# EAGLE design rStep_v2 (EAGLE 5.08)
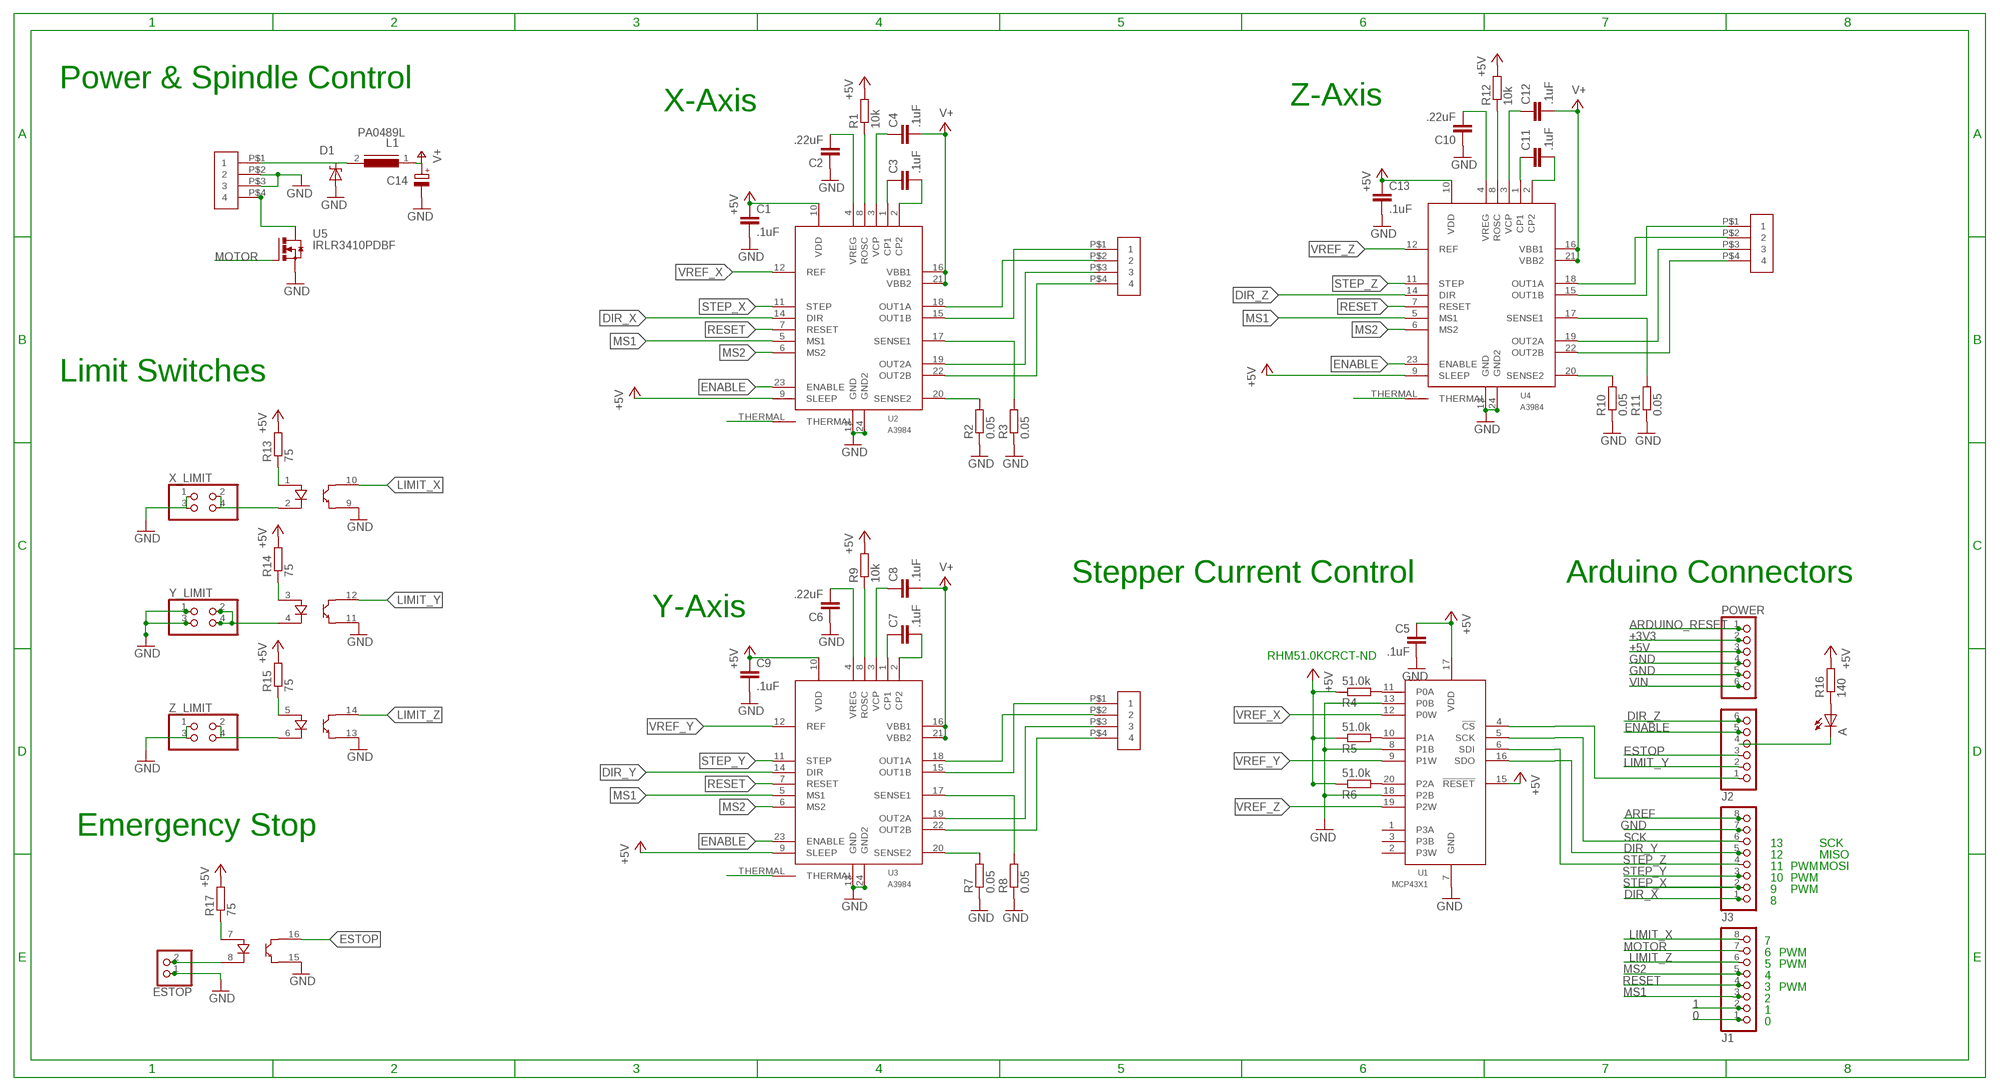
[diagram p0: schematic, sheet 1]

## Parts
A  LEDCHIP-LED0805  [CHIP-LED0805]
C1  .1uF  C-EUC0805  [C0805]
C2  .22uF  C-EUC0805  [C0805]
C3  .1uF  C-EUC0805  [C0805]
C4  .1uF  C-EUC0805  [C0805]
C5  .1uF  C-EUC0805  [C0805]
C6  .22uF  C-EUC0805  [C0805]
C7  .1uF  C-EUC0805  [C0805]
C8  .1uF  C-EUC0805  [C0805]
C9  .1uF  C-EUC0805  [C0805]
C10  .22uF  C-EUC0805  [C0805]
C11  .1uF  C-EUC0805  [C0805]
C12  .1uF  C-EUC0805  [C0805]
C13  .1uF  C-EUC0805  [C0805]
C14  CPOL-EUE5-10.5  [E5-10,5]
D1  SUPPRESSOR-SMBJ  [SMBJ]
ESTOP  PINHD-1X2  [1X02]
J1  PINHD-1X8  [1X08]
J2  PINHD-1X6  [1X06]
J3  PINHD-1X8  [1X08]
L1  PA0489L  [PA0489L]
POWER  PINHD-1X6  [1X06]
R1  10k  R-EU_R0805  [R0805]
R2  0.05  R-EU_R1206  [R1206]
R3  0.05  R-EU_R1206  [R1206]
R4  51.0k  R-EU_R0805  [R0805]
R5  51.0k  R-EU_R0805  [R0805]
R6  51.0k  R-EU_R0805  [R0805]
R7  0.05  R-EU_R1206  [R1206]
R8  0.05  R-EU_R1206  [R1206]
R9  10k  R-EU_R0805  [R0805]
R10  0.05  R-EU_R1206  [R1206]
R11  0.05  R-EU_R1206  [R1206]
R12  10k  R-EU_R0805  [R0805]
R13  75  R-EU_R0805  [R0805]
R14  75  R-EU_R0805  [R0805]
R15  75  R-EU_R0805  [R0805]
R16  140  R-EU_R0805  [R0805]
R17  75  R-EU_R0805  [R0805]
U1  MCP43X1  [TSSOP20]
U2  A3984  [TSSOP24]
U3  A3984  [TSSOP24]
U4  A3984  [TSSOP24]
U5  IRLR3410PDBF  [TO252]
U6  TCET4100  [DIL16]
X1  284392-4  [284392-4]
X2  284392-4  [284392-4]
X3  284392-4  [284392-4]
X5  OSTTC04262  [OSTTC042162]
X_LIMIT  PINHD-2X2  [2X02]
Y_LIMIT  PINHD-2X2  [2X02]
Z_LIMIT  PINHD-2X2  [2X02]

## Nets
0: J1.1
1: J1.2
!CS: J2.1 U1.4(!CS)
+3V3: POWER.2
+5V: C1.1 C5.1 C9.1 C13.1 POWER.3 R1.2 R4.1 R5.1 R6.1 R9.2 R12.2 R13.2 R14.2 R15.2 R16.2 R17.2 U1.15(!RESET) U1.17(VDD) U2.9(SLEEP) U2.10(VDD) U3.9(SLEEP) U3.10(VDD) U4.9(SLEEP) U4.10(VDD)
ARDUINO_RESET: POWER.1
AREF: J3.8
DIR_X: J3.1 U2.14(DIR)
DIR_Y: J3.5 U1.16(SDO) U3.14(DIR)
DIR_Z: J2.6 U4.14(DIR)
ENABLE: J2.5 U2.23(ENABLE) U3.23(ENABLE) U4.23(ENABLE)
ESTOP: J2.3 U6.16(C)
GND: C1.2 C2.1 C5.2 C6.1 C9.2 C10.1 C13.2 C14.- D1.A ESTOP.1 J3.7 POWER.4 POWER.5 R2.1 R3.1 R7.1 R8.1 R10.1 R11.1 U1.7(GND) U1.8(P1B) U1.13(P0B) U1.18(P2B) U2.13(GND) U2.24(GND2) U3.13(GND) U3.24(GND2) U4.13(GND) U4.24(GND2) U5.2(S) U6.9(E) U6.11(E) U6.13(E) U6.15(E) X5.P$2 X5.P$3 X_LIMIT.1 X_LIMIT.3 Y_LIMIT.1 Y_LIMIT.3 Z_LIMIT.1 Z_LIMIT.3
LIMIT_X: J1.8 U6.10(C)
LIMIT_Y: J2.2 U6.12(C)
LIMIT_Z: J1.6 U6.14(C)
MOTOR: J1.7 U5.1(G)
MS1: J1.3 U2.5(MS1) U3.5(MS1) U4.5(MS1)
MS2: J1.5 U2.6(MS2) U3.6(MS2) U4.6(MS2)
N$1: C2.2 U2.4(VREG)
N$2: C3.1 U2.1(CP1)
N$3: C3.2 U2.2(CP2)
N$4: C4.1 U2.3(VCP)
N$5: U2.18(OUT1A) X1.P$2
N$6: U2.15(OUT1B) X1.P$1
N$7: U2.19(OUT2A) X1.P$3
N$8: U2.22(OUT2B) X1.P$4
N$9: R1.1 U2.8(ROSC)
N$10: C6.2 U3.4(VREG)
N$11: C7.1 U3.1(CP1)
N$12: C7.2 U3.2(CP2)
N$13: C8.1 U3.3(VCP)
N$14: U3.18(OUT1A) X2.P$2
N$15: U3.15(OUT1B) X2.P$1
N$16: R3.2 U2.17(SENSE1)
N$17: R2.2 U2.20(SENSE2)
N$18: U3.19(OUT2A) X2.P$3
N$19: R4.2 U1.11(P0A)
N$20: R5.2 U1.10(P1A)
N$21: R6.2 U1.20(P2A)
N$22: U3.22(OUT2B) X2.P$4
N$23: R8.2 U3.17(SENSE1)
N$24: R7.2 U3.20(SENSE2)
N$25: R9.1 U3.8(ROSC)
N$26: C10.2 U4.4(VREG)
N$27: C11.1 U4.1(CP1)
N$28: C11.2 U4.2(CP2)
N$29: C12.1 U4.3(VCP)
N$30: U4.18(OUT1A) X3.P$2
N$31: U4.15(OUT1B) X3.P$1
N$32: U4.19(OUT2A) X3.P$3
N$33: U4.22(OUT2B) X3.P$4
N$34: R11.2 U4.17(SENSE1)
N$35: R10.2 U4.20(SENSE2)
N$36: R12.1 U4.8(ROSC)
N$37: A.A R16.1
N$38: D1.C L1.2 X5.P$1
N$39: R13.1 U6.1(A)
N$40: U6.6(K) Z_LIMIT.2 Z_LIMIT.4
N$41: R14.1 U6.3(A)
N$42: U6.4(K) Y_LIMIT.2 Y_LIMIT.4
N$43: R15.1 U6.5(A)
N$45: U6.2(K) X_LIMIT.2 X_LIMIT.4
N$46: A.C J2.4
N$47: R17.1 U6.7(A)
N$48: ESTOP.2 U6.8(K)
N$50: U5.3(D) X5.P$4
RESET: J1.4 U2.7(RESET) U3.7(RESET) U4.7(RESET)
SCK: J3.6 U1.5(SCK)
STEP_X: J3.2 U2.11(STEP)
STEP_Y: J3.3 U3.11(STEP)
STEP_Z: J3.4 U1.6(SDI) U4.11(STEP)
THERMAL: U2.THERMAL U3.THERMAL U4.THERMAL
V+: C4.2 C8.2 C12.2 C14.+ L1.1 U2.16(VBB1) U2.21(VBB2) U3.16(VBB1) U3.21(VBB2) U4.16(VBB1) U4.21(VBB2)
VIN: POWER.6
VREF_X: U1.12(P0W) U2.12(REF)
VREF_Y: U1.9(P1W) U3.12(REF)
VREF_Z: U1.19(P2W) U4.12(REF)
Unconnected: U1.1(P3A) U1.2(P3W) U1.3(P3B)

## Notes on the sheet
- Power & Spindle Control
- X-Axis | Z-Axis
- Limit Switches
- Stepper Current Control | Arduino Connectors
- Y-Axis
- RHM51.0KCRCT-ND
- Emergency Stop
- 13 | SCK
- 12 | MISO
- 11 | PWM | MOSI
- 10 | PWM
- 9 | PWM
- 8
- 7
- 6 | PWM
- 5 | PWM
- 4
- 3 | PWM
- 2
- 1
- 0

## Library data of the parts
A = led:LED: LED OSRAM: - CHIPLED LG R971, LG N971, LY N971, LG Q971, LY Q971, LO R971, LY R971 LH N974, LH R974 LS Q976, LO Q976, LY Q976 LO Q996 - Hyper CHIPLED LW Q18S LB Q993, LB Q99A, LB R99A - SideLED LS A670, LO A670, LY A670, LG A670, LP A670 LB A673, LV A673, LT A673, LW A673 LH A674 LY A675 LS A676, LA A676, LO A676, LY A676, LW A676 LS A679, LY A679, LG A679 - Hyper Micro SIDELED® LS Y876, LA Y876, LO Y876, LY Y876 LT Y87S - SmartLED LW L88C, LW L88S LB L89C, LB L89S, LG L890 LS L89K, LO L89K, LY L89K LS L896, LA L896, LO L896, LY L896 - TOPLED LS T670, LO T670, LY T670, LG T670, LP T670 LSG T670, LSP T670, LSY T670, LOP T670, LYG T670 LG T671, LOG T671, LSG T671 LB T673, LV T673, LT T673, LW T673 LH T674 LS T676, LA T676, LO T676, LY T676, LB T676, LH T676, LSB T676, LW T676 LB T67C, LV T67C, LT T67C, LS T67K, LO T67K, LY T67K, LW E67C LS E67B, LA E67B, LO E67B, LY E67B, LB E67C, LV E67C, LT E67C LW T67C LS T679, LY T679, LG T679 LS T770, LO T770, LY T770, LG T770, LP T770 LB T773, LV T773, LT T773, LW T773 LH T774 LS E675, LA E675, LY E675, LS T675 LS T776, LA T776, LO T776, LY T776, LB T776 LHGB T686 LT T68C, LB T68C - Hyper Mini TOPLED® LB M676 - Mini TOPLED Santana® LG M470 LS M47K, LO M47K, LY M47K Source: http://www.osram.convergy.de LUXEON: - LUMILED® LXK2-PW12-R00, LXK2-PW12-S00, LXK2-PW14-U00, LXK2-PW14-V00 LXK2-PM12-R00, LXK2-PM12-S00, LXK2-PM14-U00 LXK2-PE12-Q00, LXK2-PE12-R00, LXK2-PE12-S00, LXK2-PE14-T00, LXK2-PE14-U00 LXK2-PB12-K00, LXK2-PB12-L00, LXK2-PB12-M00, LXK2-PB14-N00, LXK2-PB14-P00, LXK2-PB14-Q00 LXK2-PR12-L00, LXK2-PR12-M00, LXK2-PR14-Q00, LXK2-PR14-R00 LXK2-PD12-Q00, LXK2-PD12-R00, LXK2-PD12-S00 LXK2-PH12-R00, LXK2-PH12-S00 LXK2-PL12-P00, LXK2-PL12-Q00, LXK2-PL12-R00 Source: www.luxeon.com KINGBRIGHT: KA-3528ASYC Source: www.kingbright.com
C1-C13 = rcl:C-EU: CAPACITOR, European symbol
C14 = rcl:CPOL-EU: POLARIZED CAPACITOR, European symbol
D1 = diode:SUPPRESSOR-: Suppressor diode
ESTOP = pinhead:PINHD-1X2: PIN HEADER
J1 J3 = pinhead:PINHD-1X8: PIN HEADER
J2 POWER = pinhead:PINHD-1X6: PIN HEADER
L1 = rStep:PA0489L
R1-R17 = rcl:R-EU_: RESISTOR, European symbol
U1 = rStep:MCP43X1
U2-U4 = rStep:A3984
U5 = rStep:IRLR3410PDBF
U6 = rStep:TCET4100
X1-X3 = rStep:284392-4
X5 = rStep:OSTTC04262
X_LIMIT Y_LIMIT Z_LIMIT = pinhead:PINHD-2X2: PIN HEADER

## Net classes
0 default: width 0.254 mm, clearance 0.254 mm
1 power: width 0.61 mm, drill 0.711 mm, clearance 0.33 mm
2 gnd: width 0.305 mm, drill 0.711 mm, clearance 0.254 mm
3 usbvcc: width 0.508 mm, drill 0.711 mm, clearance 0.254 mm
4 aref: width 0.406 mm

## Board
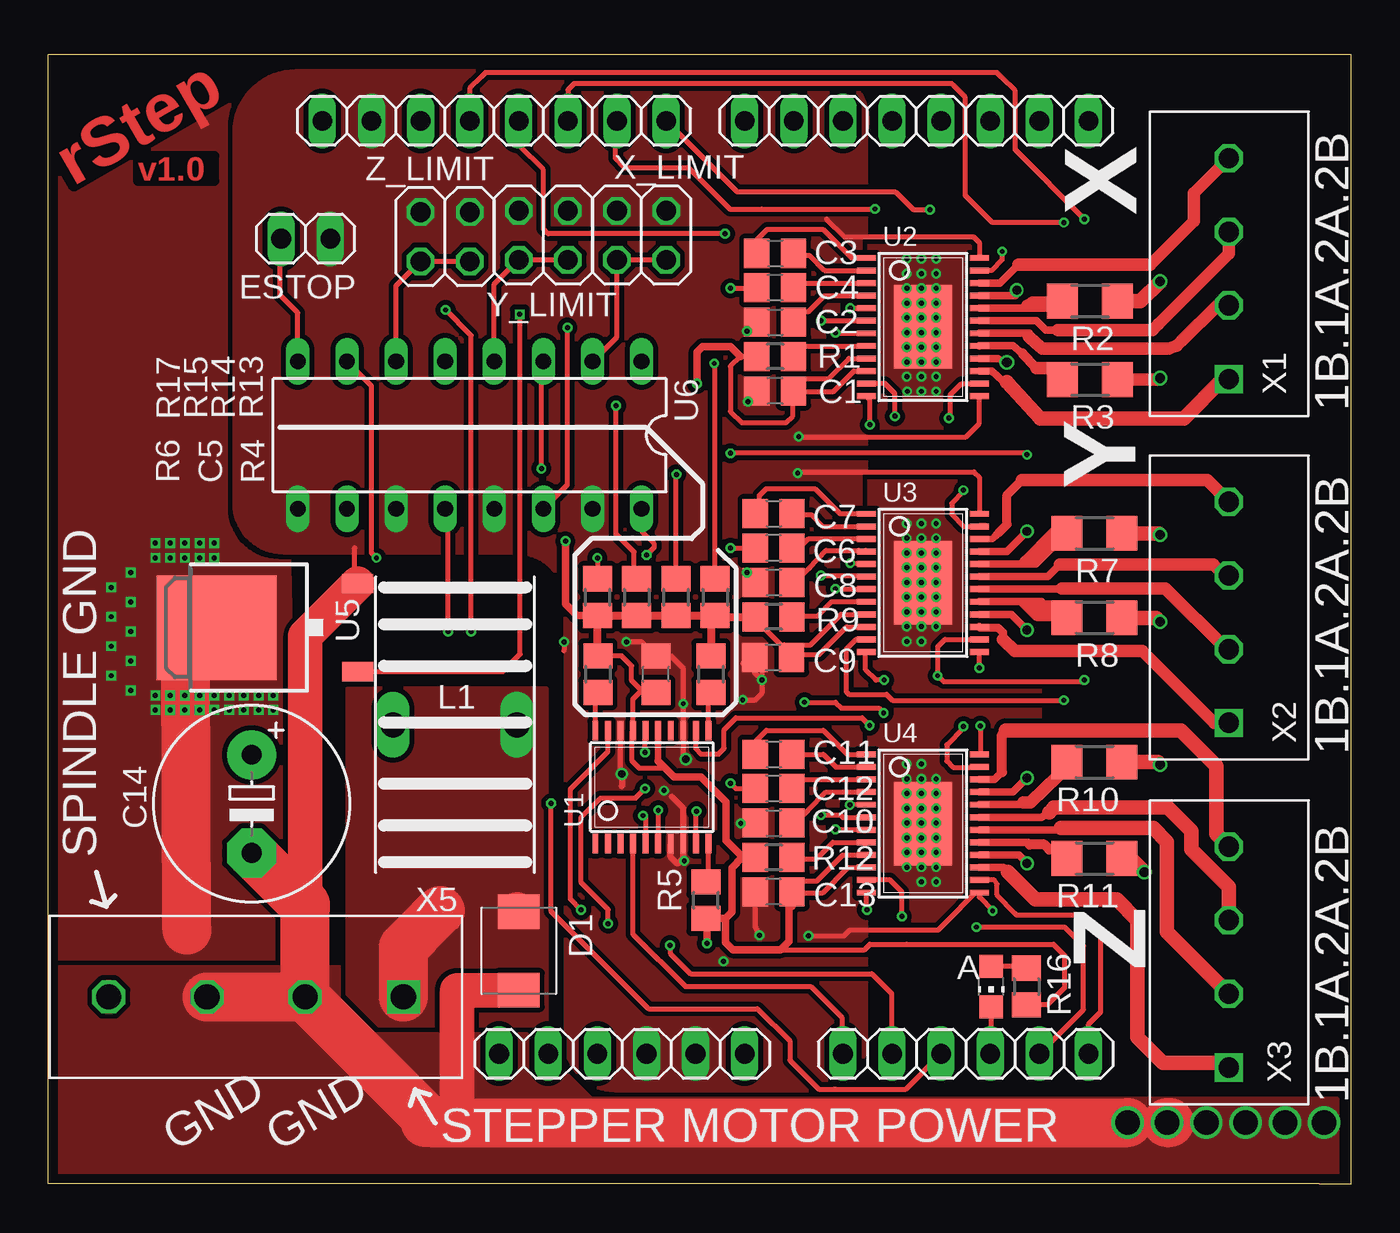
[diagram p1: board, top side]
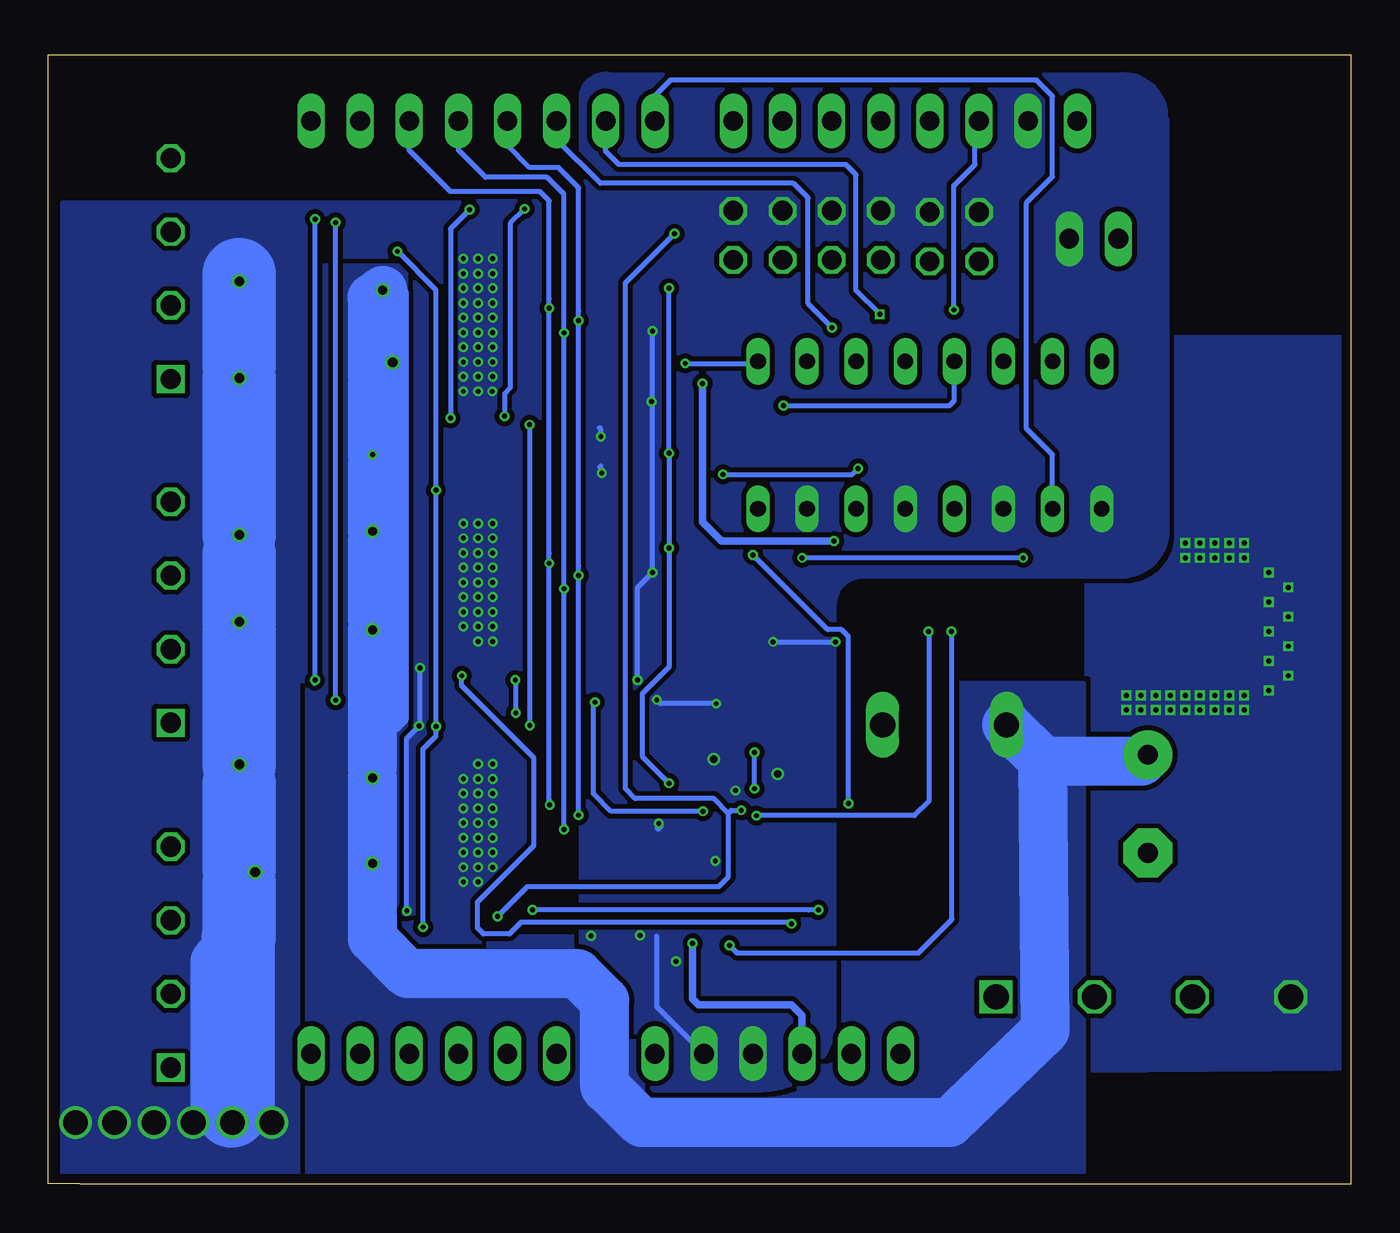
[diagram p2: board, bottom side, seen from below]

Size 67.39 x 58.42 mm. Coordinates in mm from the lower left corner, seen from the top.
Outline: 65.74,0 0,0 0,58.42 67.39,58.42 67.39,0 65.74,0
Copper layers (1*16): Top 0.035mm / dielectric 1.5mm / Bottom 0.035mm
Design rules "default *": minimum track width 10mil, minimum drill 10mil, track to track 10mil, track to pad 10mil, pad to pad 10mil, via to via 10mil, smd to smd 0mil, copper to edge 20mil, drill to drill 10mil, minimum pad ring 5mil, minimum via ring 5mil, stop-mask expansion 4mil, vias tented up to drill 0mil, thermal gap 10mil

### Footprints (pad centres in the part's own frame; a part is rotated, then mirrored left to right if it is on the bottom)
CHIP-LED0805 = smd 1.2 x 1.2: A 0,-1.05; C 0,1.05
C0805 = smd 1.3 x 1.5: 1 -0.95,0; 2 0.95,0
E5-10,5 = drill 1.016 pad 2.54 round: + -2.54,0 | drill 1.016 pad 2.54 octagon: - 2.54,0
SMBJ = smd 1.78 x 2.16: A 2.04,0; C -2.03,0
1X02 = drill 1.016 long: 1 -1.27,0; 2 1.27,0
1X08 = drill 1.016 long: 1 -8.89,0; 2 -6.35,0; 3 -3.81,0; 4 -1.27,0; 5 1.27,0; 6 3.81,0; 7 6.35,0; 8 8.89,0
1X06 = drill 1.016 long: 1 -6.35,0; 2 -3.81,0; 3 -1.27,0; 4 1.27,0; 5 3.81,0; 6 6.35,0
PA0489L = drill 1.3 long: 1 -3.2,0; 2 3.2,0
R0805 = smd 1.3 x 1.5: 1 -0.95,0; 2 0.95,0
R1206 = smd 1.6 x 1.803: 1 -1.422,0; 2 1.422,0
TSSOP20 = smd 0.305 x 0.991: 1 -2.925,-2.918; 2 -2.275,-2.918; 3 -1.625,-2.918; 4 -0.975,-2.918; 5 -0.325,-2.918; 6 0.325,-2.918; 7 0.975,-2.918; 8 1.625,-2.918; 9 2.275,-2.918; 10 2.925,-2.918; 11 2.925,2.918; 12 2.275,2.918; 13 1.625,2.918; 14 0.975,2.918; 15 0.325,2.918; 16 -0.325,2.918; 17 -0.975,2.918; 18 -1.625,2.918; 19 -2.275,2.918; 20 -2.925,2.918
TSSOP24 = smd 0.305 x 0.991: 1 -3.575,-2.918; 2 -2.925,-2.918; 3 -2.275,-2.918; 4 -1.625,-2.918; 5 -0.975,-2.918; 6 -0.325,-2.918; 7 0.325,-2.918; 8 0.975,-2.918; 9 1.625,-2.918; 10 2.275,-2.918; 11 2.925,-2.918; 12 3.575,-2.918; 13 3.575,2.918; 14 2.925,2.918; 15 2.275,2.918; 16 1.625,2.918; 17 0.975,2.918; 18 0.325,2.918; 19 -0.325,2.918; 20 -0.975,2.918; 21 -1.625,2.918; 22 -2.275,2.918; 23 -2.925,2.918; 24 -3.575,2.918 | smd 4.32 x 3: THERMAL 0,0
TO252 = smd 1 x 1.6: 1 -2.28,-4.8; 2 2.28,-4.8 | smd 5.4 x 6.2: 3 0,2.5
DIL16 = drill 0.813 long: 1 -8.89,-3.81; 2 -6.35,-3.81; 3 -3.81,-3.81; 4 -1.27,-3.81; 5 1.27,-3.81; 6 3.81,-3.81; 7 6.35,-3.81; 8 8.89,-3.81; 9 8.89,3.81; 10 6.35,3.81; 11 3.81,3.81; 12 1.27,3.81; 13 -1.27,3.81; 14 -3.81,3.81; 15 -6.35,3.81; 16 -8.89,3.81
284392-4 = drill 1.05 square: P$1 0,0 | drill 1.05 octagon: P$2 3.81,0; P$3 7.62,0; P$4 11.43,0
OSTTC042162 = drill 1.3 square: P$1 0,0 | drill 1.3 octagon: P$2 5.08,0; P$3 10.16,0; P$4 15.24,0
2X02 = drill 1.016 octagon: 1 -1.27,-1.27; 2 -1.27,1.27; 3 1.27,-1.27; 4 1.27,1.27

### Placement (x,y rotation side)
A  48.77,10.21 180 top
C1  37.59,41.02 180 top
C2  37.59,44.58 0 top
C3  37.59,48.13 0 top
C4  37.59,46.35 180 top
C5  31.42,26.37 90 top
C6  37.52,31.11 0 top
C7  37.52,34.67 0 top
C8  37.52,32.89 180 top
C9  37.49,27.23 180 top
C10  37.52,18.67 0 top
C11  37.52,22.23 0 top
C12  37.52,20.45 180 top
C13  37.52,15.11 180 top
C14  10.52,19.66 270 top
D1  24.33,12.06 270 top
ESTOP  13.31,48.9 180 top
J1  44.91,54.99 180 top
J2  47.45,6.73 0 top
J3  23.06,54.99 180 top
L1  21.03,23.75 0 top
POWER  29.67,6.73 0 top
R1  37.59,42.8 180 top
R2  53.87,45.67 180 top
R3  53.87,41.61 180 top
R4  34.26,26.37 270 top
R5  34.01,14.68 90 top
R6  28.42,26.37 270 top
R7  54.1,33.66 180 top
R8  54.1,29.29 180 top
R9  37.52,29.34 180 top
R10  54.1,21.82 180 top
R11  54.1,16.84 180 top
R12  37.52,16.89 180 top
R13  34.49,30.35 270 top
R14  32.46,30.35 270 top
R15  30.43,30.35 270 top
R16  50.6,10.21 270 top
R17  28.4,30.35 270 top
U1  31.22,20.52 0 top
U2  45.24,44.32 270 top
U3  45.24,31.09 270 top
U4  45.24,18.64 270 top
U5  11.2,28.78 90 top
U6  21.79,38.73 180 top
X1  61.06,41.63 90 top
X2  61.06,23.85 90 top
X3  61.06,6.02 90 top
X5  18.36,9.68 180 top
X_LIMIT  30.68,49.07 180 top
Y_LIMIT  25.6,49.07 180 top
Z_LIMIT  20.52,49 180 top

### Tracks (layer width: path | path; a pad name or v marks a point on that pad's centre or on a via)
!CS
  Top 0.254: U1.4 30.24,12.92 32.95,10.21 37.61,10.21 39.44,10.21 41.05,8.61 41.05,6.78 J2.1
+5V  (via drill 0.25 pad 0.46)
  Top 0.254: C1.1 38.57,41.05 39.04,41.05 39.09,41 40.61,41 41.67,42.05 U2.10 | 41.02,29.46 U3.9 41.02,29.46 | U3.10 41.29,28.82 39.85,27.38 38.64,27.38 C9.1 37.97,27.7 37.97,27.81 | U4.9 41.1,17.02 39.75,15.67 39.02,15.67 C13.1 38.52,15.06 40.06,15.06 41.36,16.37 U4.10 | R1.2 35.79,42.8 35.28,42.29 35.28,39.95 35.86,39.37 38.15,39.37 38.51,39.73 38.51,40.98 C1.1 | U2.9 41.4,42.7 40.36,41.66 39.18,41.66 C1.1 | R6.1 29.66,27.32 30.18,26.8 30.18,26.04 30.68,25.53 | 30.68,25.53 31.41,25.53 C5.1 | 30.68,25.53 30.24,25.09 U1.17 30.2,23.4 30.2,21.87 30.57,21.5 31.92,21.5 | R9.2 36.85,29.06 36.85,28.94 37.97,27.81 | 41.02,29.46 41,29.46 39.42,27.89 38.05,27.89 37.97,27.81 | 37.7,12.12 42.21,12.12 42.49,12.39 44.4,12.39 51.99,12.39 52.55,11.84 52.55,10.13 51.68,9.26 R16.2
  Top 0.33: 31.54,21.88 U1.15
  Top 0.381: v34.06,12.45 34.06,13.68 R5.1 35.03,13.73 | 38.46,14.35 38.46,15.1 C13.1 38.3,14.95 38.3,12.55 37.87,12.12 37.7,12.12 35.41,12.12 35.03,12.5 35.03,13.73 | 35.89,16.89 R12.2 | 35.89,16.89 35.36,16.36 35.36,14.06 35.03,13.73 | 35.89,16.89 35.89,16.94 35.05,17.78 35.05,19.76 33.76,21.06 32.36,21.06 31.92,21.5 31.54,21.88 | R17.2 27.34,29.4 26.75,30 v26.75,33.25 | v33.55,41.4 33.55,43.03 33.83,43.31 35.28,43.31 35.79,42.8
  Top 0.406: 29.16,29.4 R17.2 28.4,27.34 R6.1 | 29.16,29.4 R15.2 | R15.2 R14.2 | R14.2 R13.2 | R9.2 34.56,29.34 R13.2 | R14.2 R13.2 | 29.16,29.4 R15.2 | R4.1 34.26,29.17 R13.2
  Bottom 0.381: POWER.3 28.4,8.71 28.96,9.27 33.76,9.27 34.06,9.58 v34.06,12.45 | v26.75,33.25 32.56,33.25 33.55,34.24 v33.55,41.4
DIR_X  (via drill 0.25 pad 0.46)
  Top 0.254: U2.14 47.23,41.4 46.65,40.82 46.65,39.67 v46.59,39.61 | v45.59,50.4 44.74,50.4 43.81,51.32 37.13,51.32 35.62,51.32 J3.1
  Bottom 0.254: v46.59,39.61 46.59,49.41 v45.59,50.4
DIR_Y  (via drill 0.25, 0.25 pad 0.46)
  Top 0.254: J3.5 21.79,56.67 22.38,57.25 22.61,57.48 49.07,57.48 49.3,57.25 50.01,56.54 50.01,53.49 v53.59,49.91 | U3.14 46.38,28.16 46,27.79 v46,26.29 46.3,25.98 53.52,25.98 v53.59,26.06 | v28.96,13.46 28.96,14.2 27.56,15.6 27.56,18.97 28.55,19.96 30.38,19.96 v30.86,20.45 | v30.86,22.33 30.86,23.41 U1.16
  Bottom 0.254: 53.59,26.57 v53.59,49.91 | v53.59,26.06 53.59,26.57 | v53.59,26.06 53.59,25.91 53.62,25.88 | v53.59,26.06 53.59,26.57 | v46,26.29 46,25.78 42.95,22.73 42.27,22.05 42.27,17.5 45.19,14.58 45.19,13.23 44.88,12.93 43.54,12.93 42.93,13.54 38.48,13.54 29.03,13.54 v28.96,13.46 | v30.86,20.45 v30.86,22.33
DIR_Z
  Top 0.254: 53.87,6.81 J2.6 53.8,8.25 54.43,8.89 54.43,12.95 53.49,13.89 50.09,13.89 49.99,13.99 49.07,14.96 49.07,15.52 48.92,15.72 48.62,15.72 U4.14
ENABLE  (via drill 0.25 pad 0.41, 0.25 pad 0.46)
  Top 0.254: U2.23 48.78,47.25 49.33,47.8 v49.33,48.24 | U3.23 48.19,34.05 48.5,34.05 48.47,34.02 47.34,34.02 46.72,34.63 46.72,35.22 47.34,35.83 v47.34,35.88 | U4.23 48.14,21.55 46.79,21.55 46.48,21.87 46.48,22.71 47.34,23.57 v47.34,23.67 | v48.01,13.28 52.58,13.28 53.54,12.32 53.54,9.02 J2.5
  Bottom 0.254: 47.34,23.16 v47.34,23.67 | v47.34,23.67 47.34,35.37 | 47.34,35.37 v47.34,35.88 | v47.34,35.88 47.34,45.81 47.34,46.24 v49.33,48.24 | 47.34,35.37 v47.34,35.88 | 47.34,23.16 v47.34,23.67 | 47.34,23.16 48.01,22.49 v48.01,13.28
ESTOP  (via drill 0.25)
  Top 0.254: U6.16 30.68,33.76 31.34,33.1 31.34,32.94 v30.94,32.54 | v26.01,19.68 26.01,14.1 31.04,9.07 36.68,9.07 38.35,7.39 38.35,6.4 39.85,4.9 40.72,4.9 | 40.72,4.9 40.64,4.9 | 40.72,4.9 44.35,4.9 J2.3
  Bottom 0.254: v30.94,32.54 27.08,28.68 26.37,28.68 26.01,28.32 v26.01,19.68
GND  (via drill 0.25, 0.25 pad 0.41, 0.38 pad 0.41, 0.51, 0.51 pad 0.46, 1.27)
  Top 0.254: v32.84,24.84 U1.13 32.84,22.1 v32.97,21.97 | v32.84,24.84 32.84,25.35 | 32.84,25.35 32.84,26.67 32.21,27.3 31.53,27.3 C5.2 30.69,28.04 v29.9,28.04 | v29.67,21.21 29.59,21.29 U1.18 | v26.67,28.04 26.67,27.58 | C9.2 35.92,26.91 | v32.84,24.84 32.84,25.35 | v35.92,25.04 36.58,25.04 36.93,25.4 36.93,27.19 C9.2 | C6.1 36.57,31.2 v36.14,31.62 | v36.19,40.46 36.19,40.84 36.14,40.89 | C2.1 36.64,44.49 v36.14,44.12 | C9.2 36.54,26.43 v36.91,26.06 | U2.13 48.16,39.34 47.45,38.63 38.84,38.63 v38.81,38.66 | U2.24 48.16,48.7 47.85,49 41.17,49 40.26,49.91 | U3.24 48.16,36.55 47.88,36.83 38.81,36.83 v38.76,36.78 | U3.13 v48.16,26.7 | v48.21,23.7 48.21,22.27 U4.24 | C13.2 36.57,13.32 v36.78,12.85 | v48.84,14.12 48.16,14.84 U4.13 47.96,15.07 46.46,13.56 46.02,13.13 41.45,13.13 41.15,12.83 v39.32,12.83 | U5.2 15.85,31.21 15.85,32.92
  Top 0.305: 32.23,20.04 32.84,19.43 U1.8 32.84,16.86 32.54,16.56 32.19,16.91 U1.7 | v29.67,21.21 29.67,20.57
  Top 0.356: C10.1 35.79,18.67 v35.81,18.64
  Top 0.508: v57.51,33.58 57.43,33.66 | v57.51,29.08 57.3,29.29 | v57.51,21.69 57.38,21.82
  Top 0.635: R3.1 57.43,41.6 v57.51,41.68
  Top 0.762: R2.1 56.49,45.67 v57.51,46.69 | 57.43,33.66 R7.1 | 57.3,29.29 R8.1 | 57.38,21.82 R10.1 | R11.1 55.98,16.84 v56.69,16.13
  Top 1.778: D1.A 21.13,10.03 21.13,4.22 21.06,4.22 21.06,3.17 | U5.2 13.28,28.34 13.28,14.48 13.28,14.25
  Top 2.54: 20.07,3.17 19.51,3.17 | 20.45,3.17 20.07,3.17 | 20.45,3.17 20.65,3.17 21.06,3.17 v55.83,3.17 | v57.86,3.17 57.99,3.17 | C14.- 13.28,14.35 13.28,14.25 | 20.07,3.17 19.76,3.17 | X5.P$2 13.28,14.48 | X5.P$2 19.79,3.17 20.45,3.17 | X5.P$3 X5.P$2
  Bottom 0.254: v29.9,28.04 v26.67,28.04 | v35.92,25.04 35.71,24.84 v32.84,24.84 | v36.14,44.12 36.14,40.51 v36.19,40.46 36.14,40.41 v36.14,31.62 36.91,30.86 v36.91,26.06 | v38.81,38.66 38.81,39.04 38.89,39.12 | v38.76,36.78 38.76,36.96 38.86,37.06 38.86,37.08 38.81,37.13 | v48.16,26.7 48.16,23.75 v48.21,23.7 48.84,23.04 v48.84,14.12 | 35.92,12.83 35.92,9.17 POWER.5 | 56.74,15.52 57.45,15.52 57.51,15.57
  Bottom 0.356: v35.81,18.64 35.74,18.52 35.84,18.41
  Bottom 0.508: 57.51,46.18 v57.51,46.69 | 57.51,15.8 57.51,16.31
  Bottom 0.762: v56.69,16.13 56.69,15.57 56.74,15.52
  Bottom 1.778: 57.99,3.17 58.04,3.23 58.78,3.96 | 57.51,15.8 57.51,16.31 | 57.51,20.7 v57.51,21.69 | 57.51,28.57 v57.51,29.08 | 57.51,32.59 v57.51,33.58 | v57.51,41.68 57.51,42.32 | 57.51,46.18 v57.51,46.69
  Bottom 2.54: 58.78,3.96 58.78,11.51 57.56,12.72 57.51,12.78 | 57.51,15.57 57.51,15.8 | v57.51,41.68 57.51,42.32 | 57.51,32.59 v57.51,33.58 | 57.51,28.57 v57.51,29.08 | 57.51,20.7 v57.51,21.69 | 57.99,3.17 57.99,3.15
  Bottom 3.81: 57.51,12.78 57.51,15.57 | 57.51,16.31 57.51,20.7 | v57.51,21.69 57.51,28.57 | v57.51,29.08 57.51,32.59 | v57.51,33.58 v57.51,41.68 | 57.51,42.32 57.51,46.18 | v57.51,46.69 57.51,47.04 | 57.56,12.72 57.56,4.14 57.91,3.79
  other vias: 34.92,11.51 31.85,20.35 32.89,16.71 59.89,3.17 61.93,3.17 63.96,3.17 65.99,3.17
  pour Top (rank 2, no thermals): 42.27,7.39 arc-90 39.73,4.85 29.34,4.85 arc-90 26.8,7.39 26.8,26.26 26.77,30.14 arc90 24.23,32.66 12.19,32.66 arc-90 9.65,35.2 9.65,54.38 arc-90 12.83,57.56 40.36,57.56 arc-90 42.27,54.38
  pour Bottom (rank 2, no thermals): 9.58,55.07 9.58,55.45 arc-90 12.12,57.35 38.25,57.35 arc-90 39.83,56.41 39.83,6.53 arc-90 38.18,4.88 30.45,4.88 arc-90 26.72,8.61 26.72,29.95 arc90 25.22,31.45 11.89,31.45 arc-90 9.5,33.83 9.5,54.99 arc-90
  pour Bottom (rank 4, no thermals): 39.27,50.75 39.27,0.2 66.65,0.2 66.65,50.75
  pour Top (rank 2, no thermals): 0.3,11.2 21.23,11.2 28.04,4.39 66.65,4.39 66.65,0.23 0.3,0.23
LIMIT_X
  Bottom 0.254: J1.8 36.02,56.29 35.2,57.1 16.28,57.1 15.44,56.26 15.44,52.09 16.79,50.75 16.79,39.06 15.44,37.72 U6.10
LIMIT_Y  (via drill 0.25)
  Top 0.254: v32.16,12.34 32.16,11.94 33.22,10.87 42.6,10.87 43.61,9.86 43.61,6.76 J2.2 | v20.68,28.57 20.68,34.77 U6.12
  Bottom 0.254: v32.16,12.34 31.75,11.94 22.4,11.94 20.65,13.69 20.65,28.55 v20.68,28.57
LIMIT_Z  (via drill 0.25 pad 0.46)
  Top 0.254: v26.85,44.3 26.85,36.17 U6.14
  Bottom 0.254: J1.6 41.1,54.03 38.84,51.77 28.85,51.77 28.09,51 28.09,45.54 v26.85,44.3
MOTOR  (via drill 0.25)
  Top 0.254: U5.1 23.5,26.5 24.41,27.41 24.41,44.96 v24.38,44.98
  Bottom 0.254: v24.38,44.98 25.6,46.2 25.6,52.2 26.14,52.73 37.87,52.73 38.56,53.42 J1.7
MS1  (via drill 0.25 pad 0.46)
  Top 0.254: v41.45,19.61 42.3,19.63 U4.5 | U3.5 42.25,32.08 v41.48,32.11 | U2.5 42.02,45.29 42.01,45.3 v41.48,45.3
  Bottom 0.254: J1.3 48.72,53.47 46.58,51.33 41.96,51.33 41.48,50.85 41.48,45.81 | v41.48,32.11 41.48,19.89 41.48,19.71 v41.45,19.61 | v41.48,32.11 41.48,32.61 | 41.48,32.61 v41.48,45.3 | v41.48,45.3 41.48,45.81 | v41.48,32.11 41.48,32.61 | v41.48,45.3 41.48,45.81
MS2  (via drill 0.25 pad 0.46)
  Top 0.254: v39.95,19.07 40.97,19.07 41.05,19 41.1,18.95 42.3,18.95 U4.6 | U3.6 42.26,31.47 v39.95,31.47 | U2.6 v39.95,44.66
  Bottom 0.254: J1.5 43.64,53.72 42.49,52.58 41,52.58 40,51.59 40,51.56 39.95,51.51 39.95,45.17 | v39.95,19.07 v39.95,31.47 | v39.95,31.47 39.95,31.98 | 39.95,31.98 v39.95,44.66 | v39.95,44.66 39.95,45.17 | v39.95,31.47 39.95,31.98 | v39.95,44.66 39.95,45.17
N$1
  Top 0.254: U2.4 40.14,45.95 39.32,45.13 39.09,45.13 C2.2
N$2
  Top 0.254: C3.1 36.64,48.83 37.19,49.38 40.06,49.38 41.53,47.9 U2.1
N$3
  Top 0.254: U2.2 40.15,47.25 39.4,48.01 38.67,48.01 C3.2
N$4
  Top 0.254: U2.3 38.78,46.6 C4.1
N$5
  Top 0.381: U2.18 50.74,44 50.71,43.83 50.93,43.61 50.83,43.56
  Top 0.635: X1.P$2 60.45,45.44 58.62,43.61 58.37,43.36 57.96,43.2 51.41,43.2 51.07,43.5 50.71,43.83
N$6
  Top 0.381: U2.15 48.81,42.05 49.38,41.53 49.58,41.48
  Top 0.762: X1.P$1 60.76,41.63 58.72,39.6 51.31,39.6 49.58,41.48
N$7
  Top 0.381: U2.19 51.11,44.65 51.38,44.37 51.43,44.32 51.59,44.17 52.22,44.17
  Top 0.635: X1.P$3 61.06,48.13 57.4,44.48 57.15,44.22 57.1,44.17 52.22,44.17
N$8
  Top 0.381: U2.22 49.21,46.6 50.16,47.55
  Top 0.635: X1.P$4 59.26,51.26 59.26,49.81 57,47.55 50.16,47.55
N$9
  Top 0.254: U2.8 39.09,43.35 R1.1
N$10
  Top 0.254: 42.24,32.74 U3.4 42.27,32.77 41.91,32.77 40.23,32.77 39.37,31.85 38.63,31.11 C6.2
N$11
  Top 0.254: U3.1 40.95,34.66 39.65,35.97 37.13,35.97 36.78,35.61 36.78,34.88 C7.1
N$12
  Top 0.254: U3.2 40.05,34.02 39.45,34.62 38.52,34.62 C7.2
N$13
  Top 0.254: U3.3 40.44,33.38 39.32,33.38 38.84,32.89 C8.1
N$14
  Top 0.381: 60.91,27.69 X2.P$2 | U3.18 52.38,30.77 52.43,30.81
  Top 0.635: 60.91,27.69 57.78,30.81 52.43,30.81
N$15
  Top 0.406: U3.15 48.19,28.78 48.82,28.78 49.12,28.78 49.38,28.52 49.38,28.17
  Top 0.635: 49.38,28.17 49.99,27.56 56.59,27.56 60.3,23.85 X2.P$1
N$16
  Top 0.381: U2.17 49.28,43.36 49.89,43.36 50.39,42.95
  Top 0.508: 51.1,42.19 50.39,42.95
  Top 0.635: R3.2 52.12,41.94 52.12,42.19 51.21,42.19 51.1,42.19
N$17
  Top 0.305: 50.65,45.44 51.87,45.44 52.17,45.14 51.92,45.14 51.77,45.29
  Top 0.381: U2.20 52.01,45.3 52.08,45.3 R2.2
  Top 0.635: 52.01,45.3 arc-74 52.02,45.59 50.9,45.59 50.65,45.44
N$18
  Top 0.381: 60.88,31.41 X2.P$3 | U3.19 51.71,31.41 52.32,32.03
  Top 0.635: 60.88,31.41 60.26,32.03 52.32,32.03
N$19
  Top 0.254: U1.11 34.14,25.29 R4.2
N$20
  Top 0.254: U1.10 34.14,15.76 R5.2
N$21
  Top 0.254: U1.20 28.29,25.28 R6.2
N$22
  Top 0.33: U3.22 48.83,33.37 49.02,33.55
  Top 0.406: 49.02,33.55 49.17,33.71
  Top 0.457: 49.17,33.71 49.58,34.11 49.58,35.64 50.34,36.4
  Top 0.635: 50.34,36.4 58.67,36.4 59.94,36.4 X2.P$4
N$23
  Top 0.381: U3.17 51.37,30.11 52.1,29.39 52.58,29.39 R8.2
  Top 0.508: 52.1,29.39 51.1,29.39 50.45,30.04 51.14,30.04 51.23,29.94 | 51.23,29.94 51.49,29.68 | 51.23,29.94 52.06,29.94 52.18,29.82
N$24
  Top 0.381: U3.20 50.32,32.06 51.09,32.06 R7.2
  Top 0.508: 50.5,32.23 52.06,33.79 52.68,33.79 52.77,33.7 | 52.77,33.7 52.37,33.7 51,32.33 | 52.77,33.7 52.73,33.7 R7.2
N$25
  Top 0.254: U3.8 40.53,30.11 39.8,29.39 38.52,29.39 R9.1
N$26
  Top 0.254: U4.4 40.23,20.27 39.32,19.36 39.09,19.13 38.92,19.13 C10.2
N$27
  Top 0.254: C11.1 36.57,22.9 37.13,23.47 40.08,23.47 41.33,22.23 U4.1
N$28
  Top 0.254: C11.2 40.08,22.23 40.59,21.72 40.74,21.57 U4.2
N$29
  Top 0.254: U4.3 38.94,20.92 C12.1
N$30
  Top 0.381: U4.18 52.28,18.32 52.37,18.41
  Top 0.762: 52.37,18.41 56.74,18.41 57.15,18.41 57.86,17.7 57.86,13.03 X3.P$2
N$31
  Top 0.381: U4.15 49.39,16.37 49.63,16.13
  Top 0.762: X3.P$1 60.81,6.27 57.66,6.27 56.34,7.59 56.34,13.64 55.27,14.71 51.05,14.71 49.63,16.13
N$32
  Top 0.254: 51.77,19.23 51.71,19.23 51.61,19.13
  Top 0.381: U4.19 51.36,18.97 51.61,19.13
  Top 0.762: X3.P$3 61.06,15.37 59.13,17.3 59.13,18.26 58.27,19.13 57.91,19.48 52.12,19.48 52.02,19.48 51.77,19.23
N$33
  Top 0.381: U4.22 48.93,20.92 49.33,21.31
  Top 0.508: 49.33,21.31 49.33,23.24 49.53,23.44
  Top 0.762: 49.53,23.44 58.57,23.44 60.4,21.61 60.4,18.11 X3.P$4
N$34
  Top 0.381: U4.17 50.68,17.67 50.75,17.55
  Top 0.508: 52.27,17.3 51.77,17.3 51.51,17.55 50.75,17.55
  Top 0.635: 52.32,17.25 52.27,17.3 52.68,16.89 R11.2
N$35
  Top 0.381: 53.01,21.36 53.01,21.49 R10.2 | U4.20 50.43,19.62 50.44,19.74
  Top 0.635: 50.44,19.74 50.8,19.74 52.22,21.11 52.22,21.36 R10.2
N$36
  Top 0.254: U4.8 40.58,17.67 39.73,16.82 38.54,16.82 R12.1
N$37
  Top 0.254: A.A 50.5,11.26 R16.1
N$38
  Top 1.778: D1.C 24.23,14.2
  Top 2.54: 18.36,12.24 19.11,12.99 | 19.11,12.99 20.27,14.15 | X5.P$1 18.36,12.24 | 18.36,12.24 19.11,12.99
  pour Top (no thermals): 15.49,8.2 15.49,25.63 25.76,25.63 25.76,8.2
N$39  (via drill 0.25 pad 0.46)
  Top 0.254: R13.1 34.49,42.39 v34.44,42.44
  Bottom 0.254: v34.44,42.44 30.78,42.44 U6.1
N$40
  Top 0.254: U6.6 17.98,46.46 Z_LIMIT.4 Z_LIMIT.2
N$41  (via drill 0.25 pad 0.46)
  Top 0.254: R14.1 32.46,36.68 v32.49,36.7 | v25.5,37.01 25.5,42.44 U6.3
  Bottom 0.254: v32.49,36.7 25.81,36.7 v25.5,37.01
N$42
  Top 0.254: U6.4 23.06,46.53 Y_LIMIT.4 Y_LIMIT.2
N$43  (via drill 0.25 pad 0.46)
  Top 0.254: v29.36,40.26 29.36,33.63 30.3,32.69 30.3,31.43 R15.1
  Bottom 0.254: U6.5 20.52,40.51 20.78,40.26 v29.36,40.26
N$45
  Top 0.254: U6.2 29.41,43.81 X_LIMIT.4 X_LIMIT.2
N$46
  Top 0.254: A.C 48.77,6.78 J2.4
N$47  (via drill 0.25)
  Top 0.254: v28.4,32.38 R17.1 | v16.97,32.38 16.71,32.64 16.71,41.27 U6.7
  Bottom 0.254: v16.97,32.38 v28.4,32.38
N$48
  Top 0.254: U6.8 12.9,45.06 11.99,45.97 11.99,48.84 ESTOP.2
N$50  (via drill 0.25)
  Top 2.54: U5.3 7.11,27.19 7.16,13.13
  other vias: 5.54,32.38 6.3,32.38 7.06,32.38 7.82,32.38 8.59,32.38 5.54,33.15 6.3,33.15 7.06,33.15 7.82,33.15 8.59,33.15 5.54,25.27 6.3,25.27 7.06,25.27 7.82,25.27 8.59,25.27 9.35,25.27 10.11,25.27 5.54,24.51 6.3,24.51 7.06,24.51 7.82,24.51 8.59,24.51 9.35,24.51 10.11,24.51 10.87,25.27 11.63,25.27 11.63,24.51 10.87,24.51 4.27,31.62 3.25,30.86 4.27,30.1 3.25,29.34 4.27,28.57 3.25,27.81 4.27,27.05 3.25,26.29 4.27,25.53
  pour Top (rank 3, no thermals): -0.41,6.27 0.23,59.41 9.65,59.41 arc-90 10.92,41 10.92,34.59 arc90 12.4,33.12 13.03,6.27
  pour Bottom (rank 4, no thermals): -2.31,5.99 -2.34,43.76 11.17,43.76 arc-90 13.69,41.11 13.72,5.87
RESET  (via drill 0.25 pad 0.46)
  Top 0.254: v40.72,18.34 40.77,18.26 40.82,18.31 U4.7 | U3.7 42.3,30.79 v40.72,30.79 | U2.7 42.3,44.02 v40.72,44.02
  Bottom 0.254: J1.4 46.18,53.47 44.78,52.07 41.58,52.07 40.72,51.21 40.72,44.55 | v40.72,18.34 v40.72,30.79 | v40.72,30.79 40.72,31.32 | 40.72,31.32 v40.72,44.02 | v40.72,44.02 40.72,44.55 | v40.72,30.79 40.72,31.32 | v40.72,44.02 40.72,44.55
SCK  (via drill 0.25)
  Top 0.254: U1.5 30.89,18.92 v30.76,19.05 | v21.87,28.57 21.87,43.89 v20.55,45.21
  Bottom 0.254: v30.76,19.05 22.58,19.05 21.82,19.81 21.82,28.52 v21.87,28.57 | v20.55,45.21 20.55,51.64 19.46,52.73 19.46,54.79 J3.6
STEP_X  (via drill 0.25 pad 0.46)
  Top 0.254: U2.11 43.28,41.4 43.79,40.89 v43.79,39.71 | v42.76,50.43 36.89,50.43 35.24,50.43 33.11,52.57 29.82,52.57 29.81,52.56 29.33,53.05 29.33,54.91 J3.2
  Bottom 0.254: v42.76,50.43 43.5,49.69 43.5,41.19 43.79,40.89 v43.79,39.71
STEP_Y  (via drill 0.25 pad 0.46)
  Top 0.254: J3.3 26.87,56.59 27.05,56.77 27.2,56.92 46.71,56.92 46.86,56.77 47.42,56.21 47.42,51.13 48.82,49.73 52.22,49.73 v52.53,49.73 | U3.11 41.78,28.17 41.27,27.66 41.27,25.45 41.3,25.43 41.4,25.32 43.36,25.32 43.66,25.02 v52.53,25.02
  Bottom 0.254: v52.53,25.02 v52.53,49.73
STEP_Z  (via drill 0.25, 0.25 pad 0.41)
  Top 0.254: J3.4 24.33,53.72 25.6,52.45 25.6,49.4 25.86,49.15 v35,49.15 | v44.15,13.84 44.15,15.11 43.64,15.62 43.54,15.72 U4.11 | U1.6 v31.54,19.32 v31.55,19.33
  Bottom 0.254: v35,49.15 37.54,46.61 37.54,42.55 37.54,21.46 37.54,20.45 37.03,19.94 32.97,19.94 32.21,19.18 | 32.21,19.18 32.21,15.88 32.72,15.37 42.62,15.37 v44.15,13.84 | v31.55,19.33 32.05,19.33 32.21,19.18
THERMAL  (via drill 0.25 pad 0.41)
  other vias: 44.4,18.67 45.92,18.67 45.16,18.67 44.4,17.91 45.16,17.91 45.92,17.91 44.4,20.19 45.92,20.19 45.16,20.19 44.4,19.43 45.16,19.43 45.92,19.43 44.4,31.11 45.92,31.11 45.16,31.11 44.4,30.35 45.16,30.35 45.92,30.35 44.4,32.64 45.92,32.64 45.16,32.64 44.4,31.88 45.16,31.88 45.92,31.88 44.4,17.14 45.92,17.14 45.16,17.14 44.4,16.38 45.16,16.38 45.92,16.38 44.4,47.85 45.92,47.85 45.16,47.85 44.4,47.09 45.16,47.09 45.92,47.09 44.4,21.72 45.16,21.72 44.4,20.95 45.16,20.95 45.92,20.95 44.4,28.07 45.16,28.07 44.4,29.59 45.92,29.59 45.16,29.59 44.4,28.83 45.16,28.83 45.92,28.83 44.4,34.16 45.92,34.16 45.16,34.16 44.4,33.4 45.16,33.4 45.92,33.4 44.4,41.76 45.92,41.76 45.16,41.76 44.42,41 45.16,41 45.92,41 44.4,46.33 45.92,46.33 45.16,46.33 44.4,45.57 45.16,45.57 45.92,45.57 44.4,43.28 45.92,43.28 45.16,43.28 44.4,42.52 45.16,42.52 45.92,42.52 45.92,15.62 45.16,15.62 44.4,44.81 45.92,44.81 45.16,44.81 44.4,44.04 45.16,44.04 45.92,44.04
  pour Top (no thermals): 42.49,52.78 51.26,52.78 51.26,8.81 42.49,8.81
  pour Bottom (rank 2, no thermals): 41.83,52.2 41.83,11.61 50.19,11.61 50.19,52.2
V+  (via drill 0.25 pad 0.46, 0.46 pad 0.46, 0.51)
  Top 0.254: C12.2 35.56,20.45 v35.28,20.73 | v35.28,46.33 36.62,46.33 C4.2 | v35.28,32.89 C8.2 | v35.28,37.8 50.55,37.8 v50.62,37.72
  Top 0.381: U2.21 50.01,45.95 v50.09,46.23 | U3.21 49.58,32.71 v50.62,33.76 | U3.16 49.81,29.46 v50.62,28.65 | U4.21 49.88,20.27 v50.62,21.01 | U4.16 50.19,17.02 v50.62,16.59 | U2.16 49.12,42.7 v49.58,42.49
  Bottom 0.254: 35.28,33.43 v35.28,32.89 | 35.28,33.43 v35.28,37.8 v35.28,46.33 | 35.28,33.43 v35.28,32.89 | 50.62,37.19 v50.62,37.72 | v35.28,32.89 35.28,26.75 36.68,25.35 36.68,22.12 v35.28,20.73
  Bottom 0.305: 50.65,45.82 49.28,45.39 49.28,41.38 49.63,41.02
  Bottom 0.381: 50.62,45.29 50.62,45.8 50.65,45.82 | 50.62,41.35 50.62,41.58 | 50.62,41.58 50.62,41.86 | 50.62,33.22 v50.62,33.76 | v50.62,28.65 50.62,29.21 | v50.62,21.01 50.62,21.51 | v50.62,16.59 50.62,16.1 | v49.58,42.49 49.53,42.14 49.83,41.83 49.83,41.68 49.99,41.53 50.57,41.53 50.62,41.58
  Bottom 0.508: v50.09,46.23 49.1,46.23 49.02,46.15 49.02,24 49.43,23.6 49.43,24.11 49.38,24.16 49.38,40.97 49.38,40.62 49.48,40.51
  Bottom 1.778: v50.62,16.59 50.62,16.1 | v50.62,21.01 50.62,21.51 | v50.62,28.65 50.62,29.21 | 50.62,33.22 v50.62,33.76 | 50.62,37.19 v50.62,37.72 | 50.62,45.29 50.62,45.8
  Bottom 2.54: 15.95,21.87 L1.1 | 15.95,21.87 15.82,7.95 20.78,3.17 36.7,3.17 38.33,4.8 38.35,4.8 38.46,4.9 38.48,4.9 38.61,5.03 38.61,9.47 40,10.87 48.79,10.87 50.62,12.7 v50.62,16.59 v50.62,21.01 | 50.62,21.51 v50.62,28.65 | 50.62,29.21 50.62,33.22 | v50.62,33.76 50.62,37.19 | v50.62,37.72 50.62,41.35 | 50.62,41.86 50.62,45.29 | 50.65,45.82 v50.09,46.23 | 15.95,21.87 10.85,21.87 C14.+
  pour Bottom (rank 3, no thermals): 13.82,25.88 26.37,25.88 26.37,12.78 48.87,12.78 48.87,47.47 54,47.47 54,0.23 13.82,0.23
VREF_X  (via drill 0.25 pad 0.46)
  Top 0.254: 42.41,23.78 v42.48,23.71 42.09,24.11 35.56,24.11 34.95,23.5 34.95,22.53 34.65,22.23 33.78,22.23 33.49,22.52 U1.12 | v42.49,39.27 42.49,40.58 U2.12
  Bottom 0.254: v42.48,23.71 v42.48,39.26 v42.49,39.27
VREF_Y  (via drill 0.25 pad 0.46)
  Top 0.254: U1.9 33.49,19.26 v33.53,19.28 | v39.12,24.92 40.72,24.92 41.02,24.61 42.95,24.61 v43.21,24.36 | v43.23,26.06 42.8,26.06 42.27,26.59 42.27,27.46 U3.12
  Bottom 0.254: v33.53,19.28 38.28,19.28 39.19,20.19 39.19,24.84 v39.12,24.92 | v43.21,24.36 43.21,26.04 v43.23,26.06
VREF_Z  (via drill 0.25 pad 0.46)
  Top 0.254: U4.12 42.32,14.2 v42.34,14.17 | U1.19 28.94,22.36 27.58,21.01 27,20.42 27,15.6 27,14.73 v27.56,14.17 27.58,14.2
  Bottom 0.254: 28.07,14.17 v27.56,14.17 28.07,14.17 | 28.07,14.17 v42.34,14.17

### Text on the board
Top: rStep | v1.0
tPlace: X | 1B.1A.2A.2B | Y | 1B.1A.2A.2B | SPINDLE GND | Z | 1B.1A.2A.2B | STEPPER MOTOR POWER | GND | GND
tStop: rStep